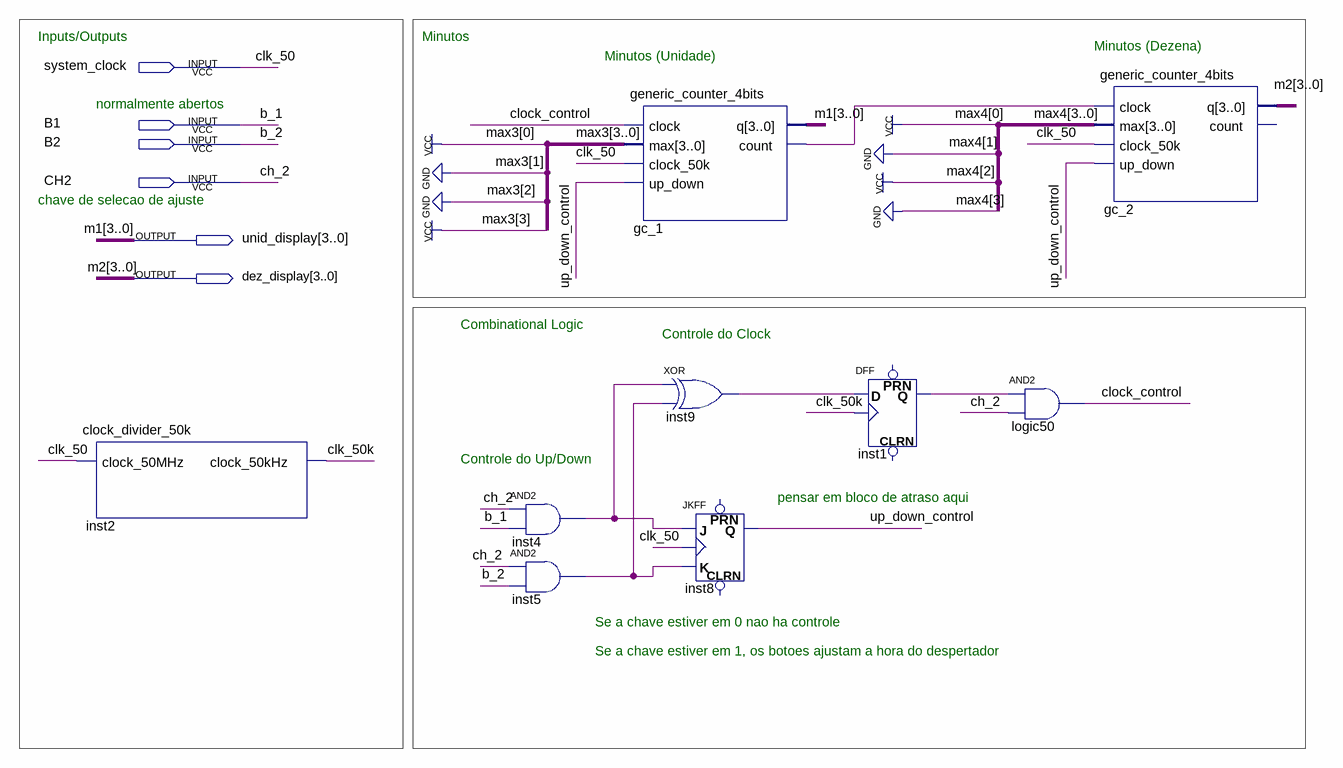
[diagram p0: schematic sheet]
// Quartus schematic minutes_alarm_clock_block.bdf as structural Verilog: 9 symbols, 6 pins
module minutes_alarm_clock_block (
  input  system_clock,
  input  B1,
  input  B2,
  input  CH2,
  output [3:0] unid_display,
  output [3:0] dez_display
);

  wire clk_50k, clock_control, gc_1_count, inst4_out, inst5_out, inst9_out, up_down_control;

  clock_divider_50k inst2 (.clock_50MHz(system_clock), .clock_50kHz(clk_50k));
  and inst4 (inst4_out, CH2, B1);
  and inst5 (inst5_out, CH2, B2);
  generic_counter_4bits gc_1 (
    .clock(clock_control), .max(4'b1001), .clock_50k(system_clock), .up_down(up_down_control),
    .q(unid_display), .count(gc_1_count));
  xor inst9 (inst9_out, inst4_out, inst5_out);
  JKFF inst8 (.K(inst5_out), .J(inst4_out), .CLK(system_clock), .Q(up_down_control));  // open: PRN, CLRN
  DFF inst1 (.CLK(clk_50k), .D(inst9_out), .Q(inst9_out));  // open: CLRN, PRN
  and logic50 (clock_control, inst9_out, CH2);
  generic_counter_4bits gc_2 (
    .clock(gc_1_count), .max(4'b0101), .clock_50k(system_clock), .up_down(up_down_control), .q(dez_display));  // open: count

  // Other names for the same wires on the sheet: b_1 = B1; b_2 = B2; ch_2 = CH2; clk_50 = system_clock;
  //   m1[3:0] = unid_display; m2[3:0] = dez_display

  // Notes on the sheet:
  //   Inputs/Outputs
  //   Minutos
  //   Minutos (Dezena)
  //   Minutos (Unidade)
  //   normalmente abertos
  //   chave de selecao de ajuste
  //   Combinational Logic
  //   Controle do Clock
  //   Controle do Up/Down
  //   pensar em bloco de atraso aqui
  //   Se a chave estiver em 0 nao ha controle
  //   Se a chave estiver em 1, os botoes ajustam a hora do despertador
endmodule
